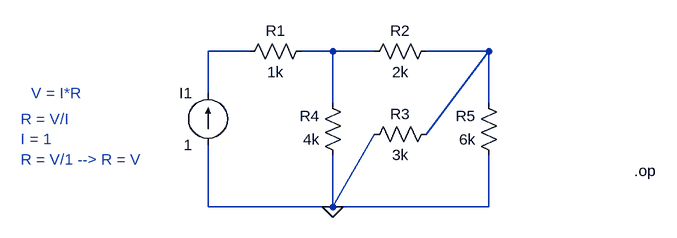
[diagram p0: schematic Lab03_02a.asc]
Lab03_02a.asc, the LTspice schematic file:
Version 4
SHEET 1 880 680
WIRE 80 96 16 96
WIRE 208 96 160 96
WIRE 272 96 208 96
WIRE 448 96 352 96
WIRE 16 160 16 96
WIRE 208 176 208 96
WIRE 448 176 448 96
WIRE 352 224 448 96
WIRE 16 336 16 240
WIRE 208 336 272 224
WIRE 208 336 208 256
WIRE 208 336 16 336
WIRE 448 336 448 256
WIRE 448 336 208 336
FLAG 208 336 0
DATAFLAG 32 96 ""
SYMBOL res 176 80 R90
WINDOW 0 0 56 VBottom 2
WINDOW 3 32 56 VTop 2
SYMATTR InstName R1
SYMATTR Value 1k
SYMBOL res 368 80 R90
WINDOW 0 0 56 VBottom 2
WINDOW 3 32 56 VTop 2
SYMATTR InstName R2
SYMATTR Value 2k
SYMBOL res 368 208 R90
WINDOW 0 0 56 VBottom 2
WINDOW 3 32 56 VTop 2
SYMATTR InstName R3
SYMATTR Value 3k
SYMBOL res 224 272 R180
WINDOW 0 36 76 Left 2
WINDOW 3 36 40 Left 2
SYMATTR InstName R4
SYMATTR Value 4k
SYMBOL res 464 272 R180
WINDOW 0 36 76 Left 2
WINDOW 3 36 40 Left 2
SYMATTR InstName R5
SYMATTR Value 6k
SYMBOL current 16 240 R180
WINDOW 0 24 80 Left 2
WINDOW 3 24 0 Left 2
WINDOW 123 0 0 Left 0
WINDOW 39 0 0 Left 0
SYMATTR InstName I1
SYMATTR Value 1
TEXT 672 280 Left 2 !.op
TEXT -256 160 Left 2 ;V = I*R
TEXT -272 200 Left 2 ;R = V/I  \nI = 1\nR = V/1 --> R = V

The netlist it stands for:
* Lab03_02a.asc
R1 N002 N001 1k
R2 N003 N002 2k
R3 N003 0 3k
R4 0 N002 4k
R5 0 N003 6k
I1 0 N001 1
.op
* V = I*R
* R = V/I
* I = 1
* R = V/1 --> R = V
.backanno
.end